# EAGLE design LDO (EAGLE 8.7.1)
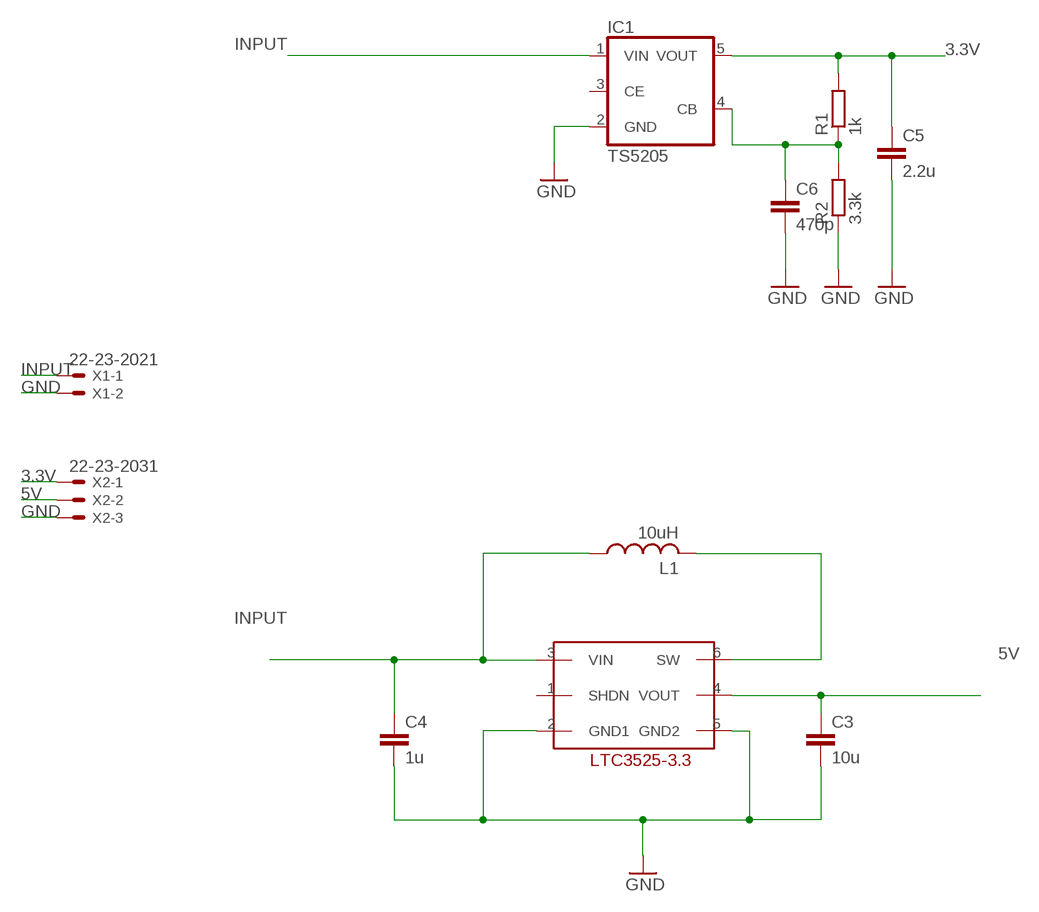
[diagram p0: schematic, sheet 1]

## Parts
C3  10u  C-EUC0805  [C0805]
C4  1u  C-EUC0805  [C0805]
C5  2.2u  C-EUC0805  [C0805]
C6  470p  C-EUC0805  [C0805]
IC1  TS5205  [SOT25]
L1  10uH  L-USL1812  [L1812]
R1  1k  R-EU_R0805  [R0805]
R2  3.3k  R-EU_R0805  [R0805]
U$1  LTC3525  [SC70-6]
X1  22-23-2021  [22-23-2021]
X2  22-23-2031  [22-23-2031]

## Nets
3.3V: C5.1 IC1.5(VOUT) R1.2 X2.1
5V: C3.1 U$1.4(VOUT) X2.2
GND: C3.2 C4.2 C5.2 C6.2 IC1.2(GND) R2.1 U$1.2(GND1) U$1.5(GND2) X1.2 X2.3
INPUT: C4.1 IC1.1(VIN) L1.1 U$1.3(VIN) X1.1
N$4: L1.2 U$1.6(SW)
N$5: C6.1 IC1.4(CB) R1.1 R2.2
Unconnected: IC1.3(CE) U$1.1(SHDN)

## Library data of the parts
C3-C6 = rcl:C-EU: CAPACITOR, European symbol; SPICEPREFIX: C
IC1 = v-reg:TS5205: 150mA Low Noise LDO Voltage Regulator with Enable TSC [Taiwan Semiconductor Company, Ltd] Source: http://www.taiwansemi.com .. 5205_0409c.pdf
L1 = rcl:L-US: INDUCTOR, American symbol; SPICEPREFIX: L
R1 R2 = rcl:R-EU_: RESISTOR, European symbol; SPICEPREFIX: R
U$1 = ltc3525:LTC3525
X1 = con-molex:22-23-2021: .100" (2.54mm) Center Header - 2 Pin; MF: MOLEX; MPN: 22-23-2021; OC_FARNELL: 1462926; OC_NEWARK: 25C3832
X2 = con-molex:22-23-2031: .100" (2.54mm) Center Header - 3 Pin; MF: MOLEX; MPN: 22-23-2031; OC_FARNELL: 1462950; OC_NEWARK: 30C0862

## Board
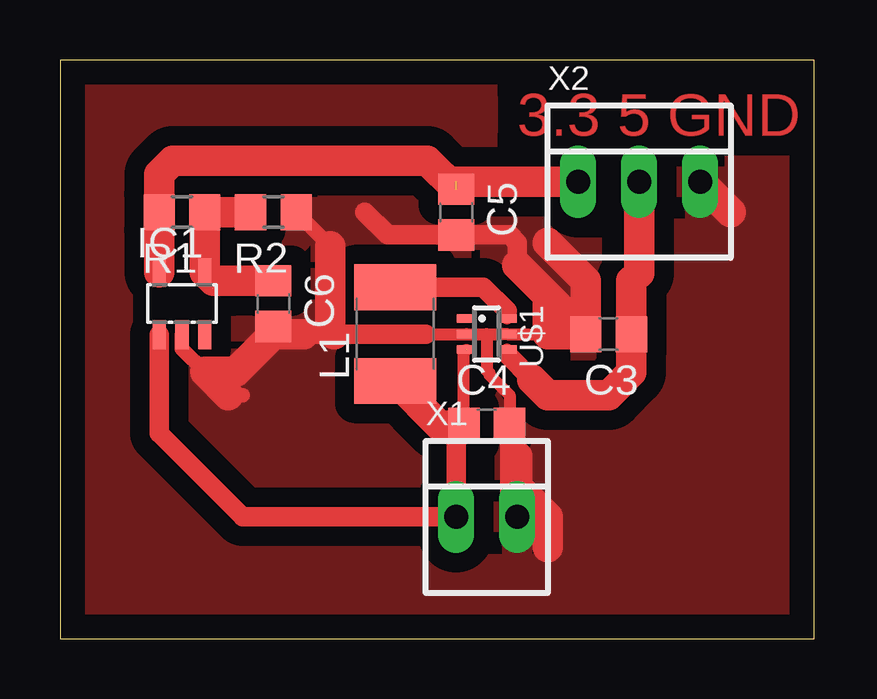
[diagram p1: board, top side]

Size 31.42 x 24.12 mm. Coordinates in mm from the lower left corner, seen from the top.
Outline: 0,0 31.42,0 31.42,24.12 0,24.12 0,0
Copper layers (1*16): Top 0.035mm / dielectric 1.5mm / Bottom 0.035mm
Design rules "default": minimum track width 6mil, minimum drill 0.35mm, track to track 6mil, track to pad 6mil, pad to pad 6mil, via to via 6mil, smd to smd 6mil, copper to edge 40mil, drill to drill 6mil, minimum pad ring 10mil, minimum via ring 8mil, stop-mask expansion 4mil, vias tented up to drill 0mil, thermal gap 10mil

### Footprints (pad centres in the part's own frame; a part is rotated, then mirrored left to right if it is on the bottom)
C0805 = smd 1.3 x 1.5: 1 -0.95,0; 2 0.95,0
SOT25 = smd 0.55 x 1.2: 1 -0.95,-1.3; 2 0,-1.3; 3 0.95,-1.3; 4 0.95,1.3; 5 -0.95,1.3
L1812 = smd 1.9 x 3.4: 1 -1.95,0; 2 1.95,0
R0805 = smd 1.3 x 1.5: 1 -0.95,0; 2 0.95,0
SC70-6 = smd 0.35 x 0.8: 1 -0.65,-0.85; 2 0,-0.85; 3 0.65,-0.85; 4 0.65,0.85; 5 0,0.85; 6 -0.65,0.85
22-23-2021 = drill 1 long: 1 -1.27,0; 2 1.27,0
22-23-2031 = drill 1 long: 1 -2.54,0; 2 0,0; 3 2.54,0

### Placement (x,y rotation side)
C3  22.86,12.7 180 top
C4  17.78,8.89 0 top
C5  16.51,17.78 270 top
C6  8.89,13.97 270 top
IC1  5.08,13.97 0 top
L1  13.97,12.7 90 top
R1  5.08,17.78 180 top
R2  8.89,17.78 180 top
U$1  17.78,12.7 270 top
X1  17.78,5.08 0 top
X2  24.13,19.05 0 top

### Tracks (layer width: path | path; a pad name or v marks a point on that pad's centre or on a via)
3.3V  (1 unrouted)
  Top 1.27: X2.1 16.51,19.05 | C5.1 15.31,19.93 4.69,19.93 4.13,19.37 R1.2 IC1.5
5V
  Top 0.508: U$1.4 18.63,11.85
  Top 0.813: 19.68,10.79 18.63,11.85 | 23.81,14.92 24.13,15.24
  Top 1.27: 24.13,15.24 X2.2 | 23.81,14.92 C3.1 23.81,11.11 22.86,10.16 20.32,10.16 19.68,10.79
GND
  Top 0.508: 15.24,12.7 U$1.2 17.78,12.7 | 17.78,12.7 18.35,12.7 18.36,12.71 U$1.5 | C4.2 18.73,10.16 17.89,11 17.89,11.08 17.78,11.18 17.78,12.7 | U$1.5 20.32,12.7 | 21.59,12.7 C3.2
  Top 0.61: 6.05,11.13 5.08,12.1 IC1.2 | 7.02,10.16 7.62,10.16 | 11.27,16.35 R2.1
  Top 0.813: 9.21,12.7 10.16,12.7 11.43,12.7 15.24,12.7 | 12.7,17.78 13.65,16.83 C5.2 18.73,16.83 19.05,16.51 19.05,15.56 | X1.2 18.73,5.4 C4.2
  Top 1.27: C6.2 9.21,12.7 | 20.48,14.13 C3.2 21.91,14.92 20.32,16.51 | 20.48,14.13 19.05,15.56 | 20.48,14.13 20.32,13.97 20.32,12.7 21.59,12.7 | 11.43,12.7 11.27,12.86 11.27,16.35 | 10.16,12.7 8.89,12.7 7.32,11.13 6.05,11.13 7.02,10.16 | X2.3 27.94,17.78 | X1.2 19.05,6.35 | 19.05,7.62 19.05,6.35 | 19.05,6.35 20.32,5.08 20.32,3.81
  pour Top (isolate 0.813): 0,24.13 0,0 31.75,0 31.75,24.13
INPUT  (1 unrouted)
  Top 0.508: C4.1 16.83,11.95 U$1.3
  Top 0.813: IC1.1 4.13,8.57 7.62,5.08 X1.1 16.51,8.57
  Top 1.27: 16.51,8.57 C4.1 15.83,8.89 L1.1
N$4
  Top 0.508: U$1.6 18.63,13.67
  Top 0.813: L1.2 17.64,14.65 18.63,13.67
N$5
  Top 1.27: R2.2 R1.1 IC1.4 6.38,14.92 C6.1

### Text on the board
Top: 3.3 5 GND